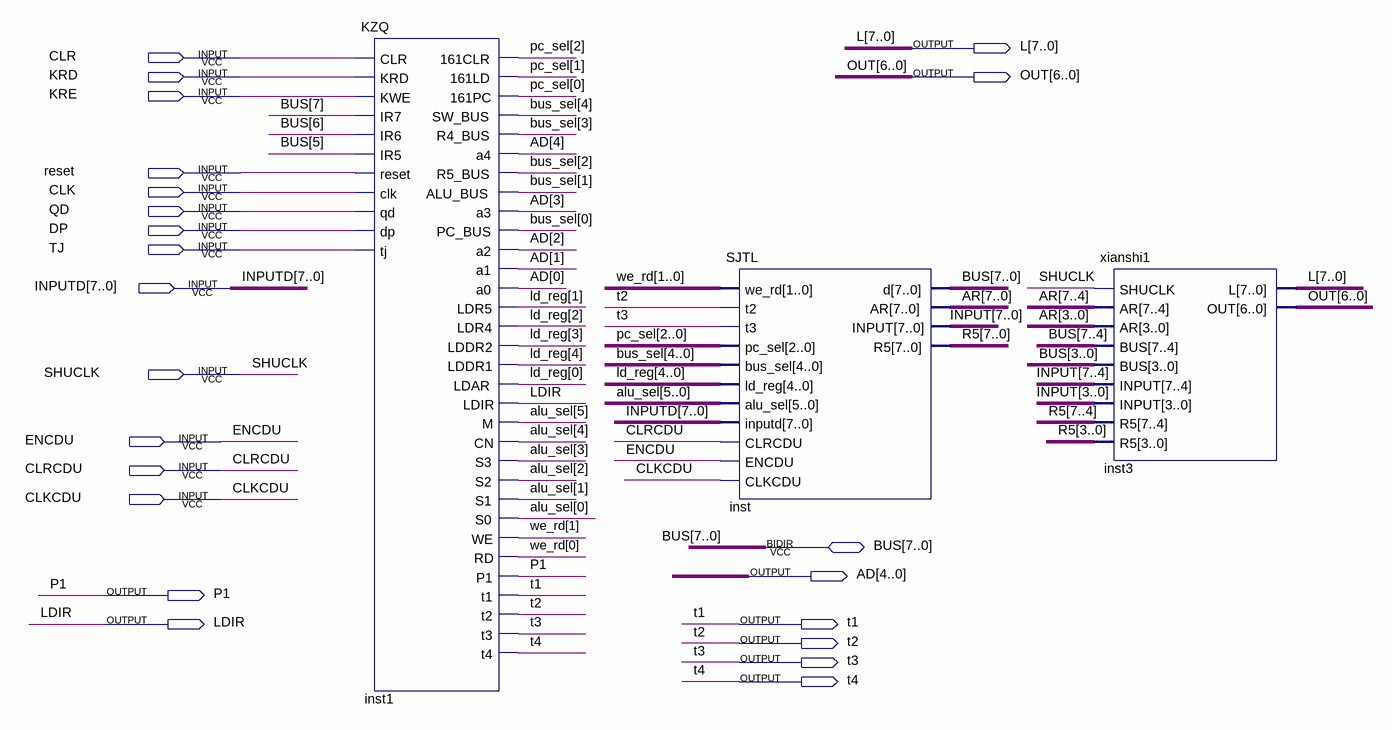
[diagram p0: schematic sheet]
// Quartus schematic MC.bdf as structural Verilog: 3 symbols, 23 pins
module MC (
  input  CLR,
  input  KRD,
  input  KRE,
  input  reset,
  input  CLK,
  input  QD,
  input  DP,
  input  TJ,
  input  [7:0] INPUTD,
  input  SHUCLK,
  input  ENCDU,
  input  CLRCDU,
  input  CLKCDU,
  inout  [7:0] BUS,
  output [7:0] L,
  output [6:0] OUT,
  output [4:0] AD,
  output P1,
  output LDIR,
  output t1,
  output t2,
  output t3,
  output t4
);

  wire [1:0] we_rd;
  wire [2:0] pc_sel;
  wire [4:0] bus_sel, ld_reg;
  wire [5:0] alu_sel;
  wire [7:0] AR, INPUT, R5;

  KZQ inst1 (
    .CLR(CLR), .KRD(KRD), .KWE(KRE), .IR7(BUS[7]), .IR6(BUS[6]), .IR5(BUS[5]), .reset(reset), .clk(CLK),
    .qd(QD), .dp(DP), .tj(TJ), .\161CLR (pc_sel[2]), .\161LD (pc_sel[1]), .\161PC (pc_sel[0]),
    .SW_BUS(bus_sel[4]), .R4_BUS(bus_sel[3]), .a4(AD[4]), .R5_BUS(bus_sel[2]), .ALU_BUS(bus_sel[1]),
    .a3(AD[3]), .PC_BUS(bus_sel[0]), .a2(AD[2]), .a1(AD[1]), .a0(AD[0]), .LDR5(ld_reg[1]), .LDR4(ld_reg[2]),
    .LDDR2(ld_reg[3]), .LDDR1(ld_reg[4]), .LDAR(ld_reg[0]), .LDIR(LDIR), .M(alu_sel[5]), .CN(alu_sel[4]),
    .S3(alu_sel[3]), .S2(alu_sel[2]), .S1(alu_sel[1]), .S0(alu_sel[0]), .WE(we_rd[1]), .RD(we_rd[0]),
    .P1(P1), .t1(t1), .t2(t2), .t3(t3), .t4(t4));
  SJTL inst (
    .we_rd(we_rd), .t2(t2), .t3(t3), .pc_sel(pc_sel), .bus_sel(bus_sel), .ld_reg(ld_reg), .alu_sel(alu_sel),
    .inputd(INPUTD), .CLRCDU(CLRCDU), .ENCDU(ENCDU), .CLKCDU(CLKCDU), .AR(AR), .INPUT(INPUT), .R5(R5), .d(BUS));
  xianshi1 inst3 (.SHUCLK(SHUCLK), .AR(AR), .BUS(BUS), .INPUT(INPUT), .R5(R5), .L(L), .OUT(OUT));
endmodule
